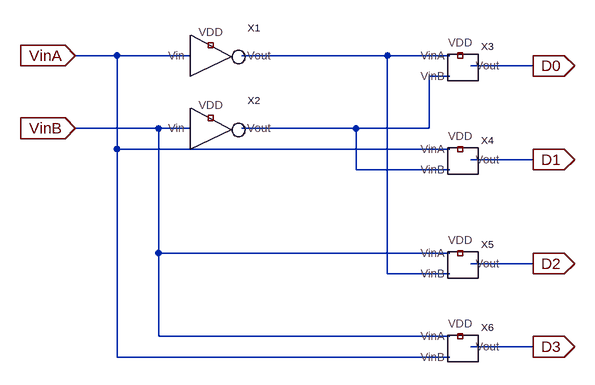
[diagram p0: schematic Decoder.asc]
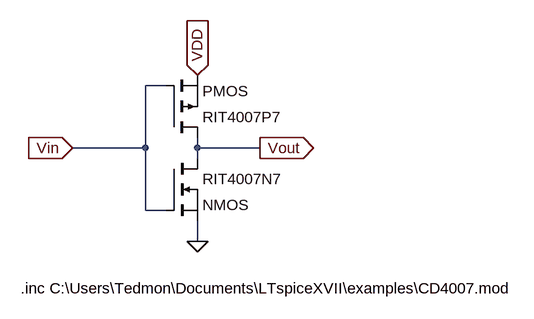
[diagram p1: sub-circuit cmosinverter.asc]
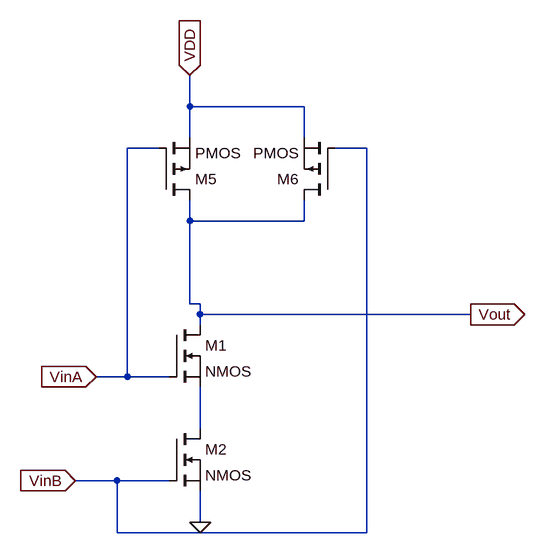
[diagram p2: sub-circuit cmosnand.asc]
Decoder.asc, the LTspice schematic file:
Version 4
SHEET 1 880 680
WIRE -48 80 -112 80
WIRE 64 80 -48 80
WIRE 368 80 144 80
WIRE 464 80 368 80
WIRE 592 96 496 96
WIRE 464 112 432 112
WIRE 16 192 -112 192
WIRE 64 192 16 192
WIRE 320 192 144 192
WIRE 432 192 432 112
WIRE 432 192 320 192
WIRE -48 224 -48 80
WIRE 464 224 -48 224
WIRE 592 240 496 240
WIRE 320 256 320 192
WIRE 464 256 320 256
WIRE 16 384 16 192
WIRE 464 384 16 384
WIRE 592 400 496 400
WIRE 368 416 368 80
WIRE 464 416 368 416
WIRE 16 512 16 384
WIRE 464 512 16 512
WIRE 592 528 496 528
WIRE -48 544 -48 224
WIRE 464 544 -48 544
FLAG -112 80 VinA
IOPIN -112 80 In
FLAG -112 192 VinB
IOPIN -112 192 In
FLAG 592 96 D0
IOPIN 592 96 Out
FLAG 592 240 D1
IOPIN 592 240 Out
FLAG 592 400 D2
IOPIN 592 400 Out
FLAG 592 528 D3
IOPIN 592 528 Out
SYMBOL CMOSInverter 96 80 R0
SYMATTR InstName X1
SYMBOL CMOSInverter 96 192 R0
SYMATTR InstName X2
SYMBOL CMOSNAND 480 96 R0
SYMATTR InstName X3
SYMBOL CMOSNAND 480 240 R0
SYMATTR InstName X4
SYMBOL CMOSNAND 480 400 R0
SYMATTR InstName X5
SYMBOL CMOSNAND 480 528 R0
SYMATTR InstName X6

cmosinverter.asc, the sub-circuit schematic file:
Version 4
SHEET 1 880 680
WIRE 176 -48 144 -48
WIRE 144 48 144 -48
WIRE 144 48 32 48
WIRE 224 48 224 32
WIRE 320 48 224 48
WIRE 224 64 224 48
WIRE 144 144 144 48
WIRE 176 144 144 144
WIRE 224 192 224 160
FLAG 224 192 0
FLAG 32 48 Vin
IOPIN 32 48 In
FLAG 320 48 Vout
IOPIN 320 48 Out
FLAG 224 -64 VDD
IOPIN 224 -64 In
SYMBOL nmos 176 64 R0
SYMATTR InstName RIT4007N7
SYMBOL pmos 176 32 M180
SYMATTR InstName RIT4007P7
TEXT -48 264 Left 2 !.inc C:\\Users\\Tedmon\\Documents\\LTspiceXVII\\examples\\CD4007.mod

cmosnand.asc, the sub-circuit schematic file:
Version 4
SHEET 1 880 680
WIRE 128 -208 128 -256
WIRE 304 -208 128 -208
WIRE 128 -160 128 -208
WIRE 304 -160 304 -208
WIRE 80 -144 32 -144
WIRE 400 -144 352 -144
WIRE 128 -32 128 -64
WIRE 304 -32 304 -64
WIRE 304 -32 128 -32
WIRE 128 96 128 -32
WIRE 144 96 128 96
WIRE 144 112 144 96
WIRE 560 112 144 112
WIRE 144 128 144 112
WIRE 32 208 32 -144
WIRE 32 208 -16 208
WIRE 96 208 32 208
WIRE 144 288 144 224
WIRE 16 368 -48 368
WIRE 96 368 16 368
WIRE 144 432 144 384
WIRE 16 448 16 368
WIRE 400 448 400 -144
WIRE 400 448 16 448
FLAG 144 432 0
FLAG 560 112 Vout
IOPIN 560 112 Out
FLAG -16 208 VinA
IOPIN -16 208 In
FLAG -48 368 VinB
IOPIN -48 368 In
FLAG 128 -256 VDD
IOPIN 128 -256 In
SYMBOL nmos 96 128 R0
SYMATTR InstName M1
SYMBOL nmos 96 288 R0
SYMATTR InstName M2
SYMBOL pmos 80 -64 M180
SYMATTR InstName M5
SYMBOL pmos 352 -64 R180
SYMATTR InstName M6

The netlist it stands for:
* Decoder.asc
XX1 VinA N001 NC_01 cmosinverter
XX2 VinB N002 NC_02 cmosinverter
XX3 N001 N002 NC_03 D0 cmosnand
XX4 VinA N002 NC_04 D1 cmosnand
XX5 VinB N001 NC_05 D2 cmosnand
XX6 VinB VinA NC_06 D3 cmosnand

* block symbol definitions
.subckt cmosinverter Vin Vout VDD
M§RIT4007N7 Vout Vin 0 0 NMOS
M§RIT4007P7 Vout Vin VDD VDD PMOS
.inc C:\Users\Tedmon\Documents\LTspiceXVII\examples\CD4007.mod
.ends cmosinverter

.subckt cmosnand VinA VinB VDD Vout
M1 Vout VinA N001 N001 NMOS
M2 N001 VinB 0 0 NMOS
M5 Vout VinA VDD VDD PMOS
M6 Vout VinB VDD VDD PMOS
.ends cmosnand

.model NMOS NMOS
.model PMOS PMOS
.lib standard.mos
.backanno
.end